# Altium project Urukul.PrjPCB (part 1 of 11)
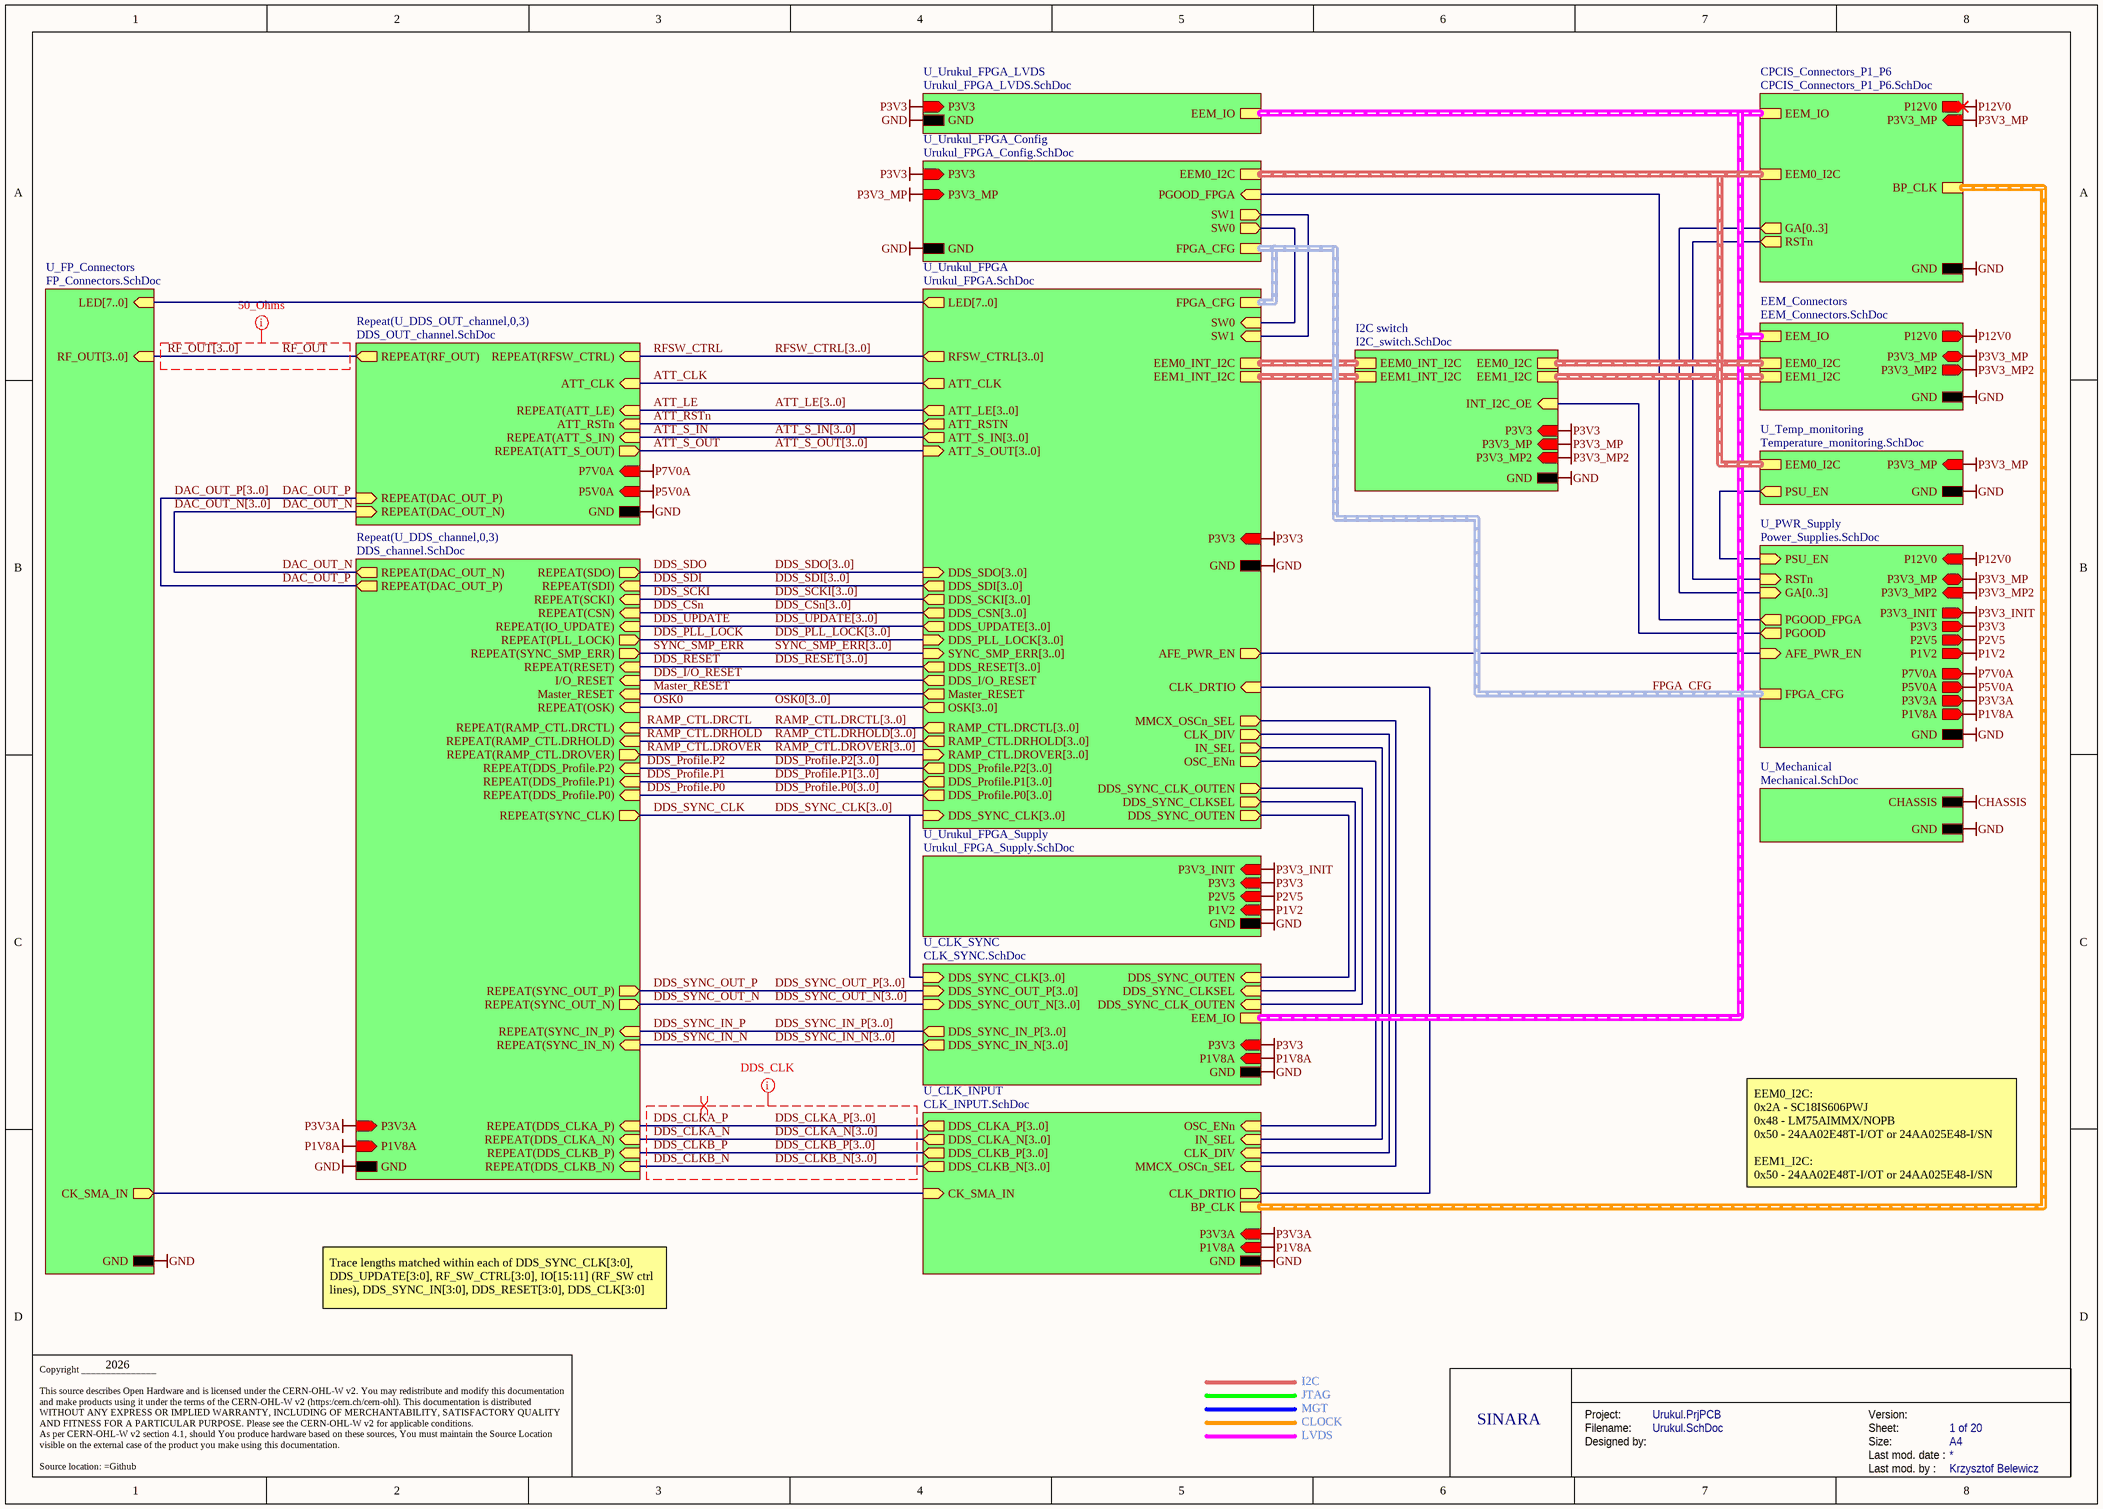
[diagram p0: Urukul.SchDoc]
P_template_version: DIOT-Template v1.3; P_version: 1.6; P_github_link: https://github.com/sinara-hw/Urukul; P_author3: Krzysztof Belewicz; P_author2: Filip Światkowski, Paweł Kulik, Maciej Przybysz; P_author1: Grzegorz Kasprowicz
20 sheets, 1353 parts. Net scope: strictly hierarchical (ports join the sheet entries above them; power ports are local).
Board file: Urukul.PcbDoc
Sheets:
  Urukul.SchDoc
    CPCIS_Connectors_P1_P6 = CPCIS_Connectors_P1_P6.SchDoc
      U_DIOT_signal_routing = DIOT_signal_routing.SchDoc
    EEM_Connectors = EEM_Connectors.SchDoc
    U_Temp_monitoring = Temperature_monitoring.SchDoc
    U_Mechanical = Mechanical.SchDoc
    U_FP_Connectors = FP_Connectors.SchDoc
    U_CLK_INPUT = CLK_INPUT.SchDoc
    U_Urukul_FPGA_Supply = Urukul_FPGA_Supply.SchDoc
    U_DDS_OUT_channel0 = DDS_OUT_channel.SchDoc
    U_DDS_OUT_channel1 = DDS_OUT_channel.SchDoc
    U_DDS_OUT_channel2 = DDS_OUT_channel.SchDoc
    U_DDS_OUT_channel3 = DDS_OUT_channel.SchDoc
    U_DDS_channel0 = DDS_channel.SchDoc
    U_DDS_channel1 = DDS_channel.SchDoc
    U_DDS_channel2 = DDS_channel.SchDoc
    U_DDS_channel3 = DDS_channel.SchDoc
    U_Urukul_FPGA = Urukul_FPGA.SchDoc
    U_CLK_SYNC = CLK_SYNC.SchDoc
    U_Urukul_FPGA_Config = Urukul_FPGA_Config.SchDoc
    U_Urukul_FPGA_LVDS = Urukul_FPGA_LVDS.SchDoc
    I2C switch = I2C_switch.SchDoc
    U_PWR_Supply = Power_Supplies.SchDoc
      U_Power-up_delay = Power-up_delay.SchDoc
      U_Power_main_DCDC = Power_main_DCDC.SchDoc
      LEDs = LEDs.SchDoc

## Sheet Urukul.SchDoc: =DocumentName
size A3; DocumentNumber: 1; Revision: 0; SheetNumber: 1; SheetTotal: 20; Version: 1.6; Author 1: Grzegorz Kasprowicz; Author 2: Filip Światkowski, Paweł Kulik, Maciej Przybysz; Author 3: Krzysztof Belewicz; Github: https://github.com/sinara-hw/Urukul; Last modified by: Krzysztof Belewicz

### Sub-sheets
CPCIS_Connectors_P1_P6 = CPCIS_Connectors_P1_P6.SchDoc: P12V0 (out), P3V3_MP (in), EEM_IO (harness EEM_LVDS), EEM0_I2C (harness I2C), BP_CLK (harness CLK_DIFF), GA[0..3] (out), GND, RSTn (out)
EEM_Connectors = EEM_Connectors.SchDoc: P3V3_MP (bidir), P12V0 (out), EEM_IO (harness EEM_LVDS), EEM0_I2C (harness I2C), GND, P3V3_MP2 (out), EEM1_I2C (harness I2C)
I2C switch = I2C_switch.SchDoc: GND, P3V3 (in), P3V3_MP (in), INT_I2C_OE (in), EEM0_I2C (harness I2C), EEM1_I2C (harness I2C), EEM0_INT_I2C (harness I2C), EEM1_INT_I2C (harness I2C), P3V3_MP2 (in)
Repeat(U_DDS_channel,0,3) = DDS_channel.SchDoc: REPEAT(CSN) (in), REPEAT(SDI) (in), REPEAT(SCKI) (in), REPEAT(SDO) (out), REPEAT(DAC_OUT_P) (out), REPEAT(DAC_OUT_N) (out), REPEAT(RESET) (in), REPEAT(IO_UPDATE) (in), REPEAT(SYNC_CLK) (out), I/O_RESET (in), REPEAT(SYNC_SMP_ERR) (out), REPEAT(PLL_LOCK) (out), Master_RESET (in), REPEAT(OSK) (in), GND, P1V8A (in), P3V3A (in), REPEAT(SYNC_IN_P) (in), REPEAT(SYNC_IN_N) (in), REPEAT(SYNC_OUT_P) (out), REPEAT(SYNC_OUT_N) (out), REPEAT(DDS_CLKB_P) (in), REPEAT(DDS_CLKB_N) (in), REPEAT(DDS_CLKA_P) (in), REPEAT(DDS_CLKA_N) (in), REPEAT(RAMP_CTL.DROVER) (out), REPEAT(RAMP_CTL.DRHOLD) (in), REPEAT(RAMP_CTL.DRCTL) (in), REPEAT(DDS_Profile.P2) (in), REPEAT(DDS_Profile.P1) (in), REPEAT(DDS_Profile.P0) (in)
Repeat(U_DDS_OUT_channel,0,3) = DDS_OUT_channel.SchDoc: REPEAT(RF_OUT) (out), REPEAT(RFSW_CTRL) (in), ATT_CLK (in), REPEAT(ATT_S_IN) (in), REPEAT(ATT_LE) (in), ATT_RSTn (in), REPEAT(ATT_S_OUT) (out), GND, P7V0A (in), P5V0A (in), REPEAT(DAC_OUT_P) (in), REPEAT(DAC_OUT_N) (in)
U_CLK_INPUT = CLK_INPUT.SchDoc: DDS_CLKA_P[3..0] (out), DDS_CLKA_N[3..0] (out), BP_CLK (harness CLK_DIFF), CK_SMA_IN (in), IN_SEL (in), CLK_DIV (in), MMCX_OSCn_SEL (in), OSC_ENn (in), DDS_CLKB_P[3..0] (out), DDS_CLKB_N[3..0] (out), P3V3A (in), GND, P1V8A (in), CLK_DRTIO (out)
U_CLK_SYNC = CLK_SYNC.SchDoc: DDS_SYNC_OUT_P[3..0] (in), DDS_SYNC_OUT_N[3..0] (in), DDS_SYNC_IN_P[3..0] (out), DDS_SYNC_IN_N[3..0] (out), DDS_SYNC_CLK_OUTEN (in), DDS_SYNC_CLKSEL (in), DDS_SYNC_OUTEN (in), EEM_IO (harness EEM_LVDS), DDS_SYNC_CLK[3..0] (in), GND, P3V3 (in), P1V8A (in)
U_FP_Connectors = FP_Connectors.SchDoc: GND, CK_SMA_IN (out), LED[7..0] (in), RF_OUT[3..0] (in)
U_Mechanical = Mechanical.SchDoc: CHASSIS, GND
U_PWR_Supply = Power_Supplies.SchDoc: GND, P12V0 (in), P3V3 (out), P3V3_MP (bidir), PGOOD (out), GA[0..3] (in), RSTn (in), PSU_EN (in), P3V3_MP2 (in), P3V3_INIT (out), P2V5 (out), P1V2 (out), P3V3A (out), P1V8A (out), P5V0A (out), P7V0A (out), AFE_PWR_EN (in), PGOOD_FPGA (out), FPGA_CFG (harness FPGA_CFG)
U_Temp_monitoring = Temperature_monitoring.SchDoc: GND, P3V3_MP (in), EEM0_I2C (harness I2C), PSU_EN (out)
U_Urukul_FPGA = Urukul_FPGA.SchDoc: EEM0_INT_I2C (harness I2C), EEM1_INT_I2C (harness I2C), LED[7..0] (out), FPGA_CFG (harness FPGA_CFG), SW0 (in), RFSW_CTRL[3..0] (out), DDS_SYNC_CLK[3..0] (in), ATT_S_IN[3..0] (out), ATT_S_OUT[3..0] (in), OSK[3..0] (out), ATT_CLK (out), ATT_LE[3..0] (out), ATT_RSTN (out), Master_RESET (out), DDS_UPDATE[3..0] (out), DDS_CSN[3..0] (out), DDS_SCKI[3..0] (out), DDS_SDI[3..0] (out), DDS_SDO[3..0] (in), DDS_I/O_RESET (out), DDS_PLL_LOCK[3..0] (in), SYNC_SMP_ERR[3..0] (in), DDS_RESET[3..0] (out), SW1 (in), GND, P3V3 (in), AFE_PWR_EN (out), DDS_SYNC_CLKSEL (out), DDS_SYNC_OUTEN (out), DDS_SYNC_CLK_OUTEN (out), IN_SEL (out), CLK_DIV (out), MMCX_OSCn_SEL (out), OSC_ENn (out), CLK_DRTIO (in), RAMP_CTL.DRCTL[3..0] (out), RAMP_CTL.DRHOLD[3..0] (out), RAMP_CTL.DROVER[3..0] (in), DDS_Profile.P2[3..0] (out), DDS_Profile.P1[3..0] (out), DDS_Profile.P0[3..0] (out)
U_Urukul_FPGA_Config = Urukul_FPGA_Config.SchDoc: PGOOD_FPGA (in), FPGA_CFG (harness FPGA_CFG), SW0 (out), SW1 (out), GND, P3V3_MP (in), P3V3 (in), EEM0_I2C (harness I2C)
U_Urukul_FPGA_LVDS = Urukul_FPGA_LVDS.SchDoc: EEM_IO (harness EEM_LVDS), GND, P3V3 (in)
U_Urukul_FPGA_Supply = Urukul_FPGA_Supply.SchDoc: P3V3_INIT (in), P3V3 (in), P2V5 (in), P1V2 (in), GND

### Nets
GND: sheet CPCIS_Connectors_P1_P6/GND, sheet EEM_Connectors/GND, sheet U_Temp_monitoring/GND, sheet U_Mechanical/GND, sheet U_FP_Connectors/GND, sheet U_CLK_INPUT/GND, sheet U_Urukul_FPGA_Supply/GND, sheet Repeat(U_DDS_OUT_channel,0,3)/GND, sheet Repeat(U_DDS_channel,0,3)/GND, sheet U_Urukul_FPGA/GND, sheet U_CLK_SYNC/GND, sheet U_Urukul_FPGA_Config/GND, sheet U_Urukul_FPGA_LVDS/GND, sheet I2C switch/GND, sheet U_PWR_Supply/GND
P1V2: sheet U_Urukul_FPGA_Supply/P1V2, sheet U_PWR_Supply/P1V2
P1V8A: sheet U_CLK_INPUT/P1V8A, sheet Repeat(U_DDS_channel,0,3)/P1V8A, sheet U_CLK_SYNC/P1V8A, sheet U_PWR_Supply/P1V8A
P2V5: sheet U_Urukul_FPGA_Supply/P2V5, sheet U_PWR_Supply/P2V5
P3V3: sheet U_Urukul_FPGA_Supply/P3V3, sheet U_Urukul_FPGA/P3V3, sheet U_CLK_SYNC/P3V3, sheet U_Urukul_FPGA_Config/P3V3, sheet U_Urukul_FPGA_LVDS/P3V3, sheet I2C switch/P3V3, sheet U_PWR_Supply/P3V3
P3V3_INIT: sheet U_Urukul_FPGA_Supply/P3V3_INIT, sheet U_PWR_Supply/P3V3_INIT
P3V3_MP: sheet CPCIS_Connectors_P1_P6/P3V3_MP, sheet EEM_Connectors/P3V3_MP, sheet U_Temp_monitoring/P3V3_MP, sheet U_Urukul_FPGA_Config/P3V3_MP, sheet I2C switch/P3V3_MP, sheet U_PWR_Supply/P3V3_MP
P3V3_MP2: sheet EEM_Connectors/P3V3_MP2, sheet I2C switch/P3V3_MP2, sheet U_PWR_Supply/P3V3_MP2
P3V3A: sheet U_CLK_INPUT/P3V3A, sheet Repeat(U_DDS_channel,0,3)/P3V3A, sheet U_PWR_Supply/P3V3A
P5V0A: sheet Repeat(U_DDS_OUT_channel,0,3)/P5V0A, sheet U_PWR_Supply/P5V0A
P7V0A: sheet Repeat(U_DDS_OUT_channel,0,3)/P7V0A, sheet U_PWR_Supply/P7V0A
P12V0: sheet CPCIS_Connectors_P1_P6/P12V0, sheet EEM_Connectors/P12V0, sheet U_PWR_Supply/P12V0
AFE_PWR_EN: sheet U_Urukul_FPGA/AFE_PWR_EN, sheet U_PWR_Supply/AFE_PWR_EN
ATT_CLK: sheet Repeat(U_DDS_OUT_channel,0,3)/ATT_CLK, sheet U_Urukul_FPGA/ATT_CLK
ATT_LE: sheet Repeat(U_DDS_OUT_channel,0,3)/REPEAT(ATT_LE)
ATT_RSTn: sheet Repeat(U_DDS_OUT_channel,0,3)/ATT_RSTn, sheet U_Urukul_FPGA/ATT_RSTN
ATT_S_IN: sheet Repeat(U_DDS_OUT_channel,0,3)/REPEAT(ATT_S_IN)
ATT_S_OUT: sheet Repeat(U_DDS_OUT_channel,0,3)/REPEAT(ATT_S_OUT)
CK_SMA_IN: sheet U_FP_Connectors/CK_SMA_IN, sheet U_CLK_INPUT/CK_SMA_IN
CLK_DIV: sheet U_CLK_INPUT/CLK_DIV, sheet U_Urukul_FPGA/CLK_DIV
CLK_DRTIO: sheet U_CLK_INPUT/CLK_DRTIO, sheet U_Urukul_FPGA/CLK_DRTIO
DAC_OUT_N: sheet Repeat(U_DDS_OUT_channel,0,3)/REPEAT(DAC_OUT_N), sheet Repeat(U_DDS_channel,0,3)/REPEAT(DAC_OUT_N)
DAC_OUT_P: sheet Repeat(U_DDS_OUT_channel,0,3)/REPEAT(DAC_OUT_P), sheet Repeat(U_DDS_channel,0,3)/REPEAT(DAC_OUT_P)
DDS_CLKA_N: sheet Repeat(U_DDS_channel,0,3)/REPEAT(DDS_CLKA_N)
DDS_CLKA_P: sheet Repeat(U_DDS_channel,0,3)/REPEAT(DDS_CLKA_P)
DDS_CLKB_N: sheet Repeat(U_DDS_channel,0,3)/REPEAT(DDS_CLKB_N)
DDS_CLKB_P: sheet Repeat(U_DDS_channel,0,3)/REPEAT(DDS_CLKB_P)
DDS_CSn: sheet Repeat(U_DDS_channel,0,3)/REPEAT(CSN)
DDS_I/O_RESET: sheet Repeat(U_DDS_channel,0,3)/I/O_RESET, sheet U_Urukul_FPGA/DDS_I/O_RESET
DDS_PLL_LOCK: sheet Repeat(U_DDS_channel,0,3)/REPEAT(PLL_LOCK)
DDS_Profile.P0: sheet Repeat(U_DDS_channel,0,3)/REPEAT(DDS_Profile.P0)
DDS_Profile.P1: sheet Repeat(U_DDS_channel,0,3)/REPEAT(DDS_Profile.P1)
DDS_Profile.P2: sheet Repeat(U_DDS_channel,0,3)/REPEAT(DDS_Profile.P2)
DDS_RESET: sheet Repeat(U_DDS_channel,0,3)/REPEAT(RESET)
DDS_SCKI: sheet Repeat(U_DDS_channel,0,3)/REPEAT(SCKI)
DDS_SDI: sheet Repeat(U_DDS_channel,0,3)/REPEAT(SDI)
DDS_SDO: sheet Repeat(U_DDS_channel,0,3)/REPEAT(SDO)
DDS_SYNC_CLK: sheet Repeat(U_DDS_channel,0,3)/REPEAT(SYNC_CLK)
DDS_SYNC_CLK_OUTEN: sheet U_Urukul_FPGA/DDS_SYNC_CLK_OUTEN, sheet U_CLK_SYNC/DDS_SYNC_CLK_OUTEN
DDS_SYNC_CLKSEL: sheet U_Urukul_FPGA/DDS_SYNC_CLKSEL, sheet U_CLK_SYNC/DDS_SYNC_CLKSEL
DDS_SYNC_IN_N: sheet Repeat(U_DDS_channel,0,3)/REPEAT(SYNC_IN_N)
DDS_SYNC_IN_P: sheet Repeat(U_DDS_channel,0,3)/REPEAT(SYNC_IN_P)
DDS_SYNC_OUT_N: sheet Repeat(U_DDS_channel,0,3)/REPEAT(SYNC_OUT_N)
DDS_SYNC_OUT_P: sheet Repeat(U_DDS_channel,0,3)/REPEAT(SYNC_OUT_P)
DDS_SYNC_OUTEN: sheet U_Urukul_FPGA/DDS_SYNC_OUTEN, sheet U_CLK_SYNC/DDS_SYNC_OUTEN
DDS_UPDATE: sheet Repeat(U_DDS_channel,0,3)/REPEAT(IO_UPDATE)
IN_SEL: sheet U_CLK_INPUT/IN_SEL, sheet U_Urukul_FPGA/IN_SEL
INT_I2C_OE: sheet I2C switch/INT_I2C_OE, sheet U_PWR_Supply/PGOOD
Master_RESET: sheet Repeat(U_DDS_channel,0,3)/Master_RESET, sheet U_Urukul_FPGA/Master_RESET
MMCX_OSCn_SEL: sheet U_CLK_INPUT/MMCX_OSCn_SEL, sheet U_Urukul_FPGA/MMCX_OSCn_SEL
OSC_ENn: sheet U_CLK_INPUT/OSC_ENn, sheet U_Urukul_FPGA/OSC_ENn
OSK0: sheet Repeat(U_DDS_channel,0,3)/REPEAT(OSK)
PGOOD_FPGA: sheet U_Urukul_FPGA_Config/PGOOD_FPGA, sheet U_PWR_Supply/PGOOD_FPGA
PSU_EN: sheet U_Temp_monitoring/PSU_EN, sheet U_PWR_Supply/PSU_EN
RAMP_CTL.DRCTL: sheet Repeat(U_DDS_channel,0,3)/REPEAT(RAMP_CTL.DRCTL)
RAMP_CTL.DRHOLD: sheet Repeat(U_DDS_channel,0,3)/REPEAT(RAMP_CTL.DRHOLD)
RAMP_CTL.DROVER: sheet Repeat(U_DDS_channel,0,3)/REPEAT(RAMP_CTL.DROVER)
RF_OUT: sheet Repeat(U_DDS_OUT_channel,0,3)/REPEAT(RF_OUT)
RFSW_CTRL: sheet Repeat(U_DDS_OUT_channel,0,3)/REPEAT(RFSW_CTRL)
RSTn: sheet CPCIS_Connectors_P1_P6/RSTn, sheet U_PWR_Supply/RSTn
SW0: sheet U_Urukul_FPGA/SW0, sheet U_Urukul_FPGA_Config/SW0
SW1: sheet U_Urukul_FPGA/SW1, sheet U_Urukul_FPGA_Config/SW1
SYNC_SMP_ERR: sheet Repeat(U_DDS_channel,0,3)/REPEAT(SYNC_SMP_ERR)

### Buses and harness runs
bus ATT_LE[3..0] = sheet U_Urukul_FPGA/ATT_LE[3..0]
bus ATT_S_IN[3..0] = sheet U_Urukul_FPGA/ATT_S_IN[3..0]
bus ATT_S_OUT[3..0] = sheet U_Urukul_FPGA/ATT_S_OUT[3..0]
bus DAC_OUT_N[3..0]
bus DAC_OUT_P[3..0]
bus DDS_CLKA_N[3..0] = sheet U_CLK_INPUT/DDS_CLKA_N[3..0]
bus DDS_CLKA_P[3..0] = sheet U_CLK_INPUT/DDS_CLKA_P[3..0]
bus DDS_CLKB_N[3..0] = sheet U_CLK_INPUT/DDS_CLKB_N[3..0]
bus DDS_CLKB_P[3..0] = sheet U_CLK_INPUT/DDS_CLKB_P[3..0]
bus DDS_CSn[3..0] = sheet U_Urukul_FPGA/DDS_CSN[3..0]
bus DDS_PLL_LOCK[3..0] = sheet U_Urukul_FPGA/DDS_PLL_LOCK[3..0]
bus DDS_Profile.P0[3..0] = sheet U_Urukul_FPGA/DDS_Profile.P0[3..0]
bus DDS_Profile.P1[3..0] = sheet U_Urukul_FPGA/DDS_Profile.P1[3..0]
bus DDS_Profile.P2[3..0] = sheet U_Urukul_FPGA/DDS_Profile.P2[3..0]
bus DDS_RESET[3..0] = sheet U_Urukul_FPGA/DDS_RESET[3..0]
bus DDS_SCKI[3..0] = sheet U_Urukul_FPGA/DDS_SCKI[3..0]
bus DDS_SDI[3..0] = sheet U_Urukul_FPGA/DDS_SDI[3..0]
bus DDS_SDO[3..0] = sheet U_Urukul_FPGA/DDS_SDO[3..0]
bus DDS_SYNC_CLK[3..0] = sheet U_CLK_SYNC/DDS_SYNC_CLK[3..0] = sheet U_Urukul_FPGA/DDS_SYNC_CLK[3..0]
bus DDS_SYNC_IN_N[3..0] = sheet U_CLK_SYNC/DDS_SYNC_IN_N[3..0]
bus DDS_SYNC_IN_P[3..0] = sheet U_CLK_SYNC/DDS_SYNC_IN_P[3..0]
bus DDS_SYNC_OUT_N[3..0] = sheet U_CLK_SYNC/DDS_SYNC_OUT_N[3..0]
bus DDS_SYNC_OUT_P[3..0] = sheet U_CLK_SYNC/DDS_SYNC_OUT_P[3..0]
bus DDS_UPDATE[3..0] = sheet U_Urukul_FPGA/DDS_UPDATE[3..0]
bus OSK0[3..0] = sheet U_Urukul_FPGA/OSK[3..0]
bus RAMP_CTL.DRCTL[3..0] = sheet U_Urukul_FPGA/RAMP_CTL.DRCTL[3..0]
bus RAMP_CTL.DRHOLD[3..0] = sheet U_Urukul_FPGA/RAMP_CTL.DRHOLD[3..0]
bus RAMP_CTL.DROVER[3..0] = sheet U_Urukul_FPGA/RAMP_CTL.DROVER[3..0]
bus RF_OUT[3..0] = sheet U_FP_Connectors/RF_OUT[3..0]
bus RFSW_CTRL[3..0] = sheet U_Urukul_FPGA/RFSW_CTRL[3..0]
bus sheet CPCIS_Connectors_P1_P6/GA[0..3] = sheet U_PWR_Supply/GA[0..3]
bus sheet U_FP_Connectors/LED[7..0] = sheet U_Urukul_FPGA/LED[7..0]
bus SYNC_SMP_ERR[3..0] = sheet U_Urukul_FPGA/SYNC_SMP_ERR[3..0]
harness FPGA_CFG = sheet U_PWR_Supply/FPGA_CFG = sheet U_Urukul_FPGA/FPGA_CFG = sheet U_Urukul_FPGA_Config/FPGA_CFG
harness sheet CPCIS_Connectors_P1_P6/BP_CLK = sheet U_CLK_INPUT/BP_CLK
harness sheet CPCIS_Connectors_P1_P6/EEM0_I2C = sheet EEM_Connectors/EEM0_I2C = sheet I2C switch/EEM0_I2C = sheet U_Temp_monitoring/EEM0_I2C = sheet U_Urukul_FPGA_Config/EEM0_I2C
harness sheet CPCIS_Connectors_P1_P6/EEM_IO = sheet EEM_Connectors/EEM_IO = sheet U_CLK_SYNC/EEM_IO = sheet U_Urukul_FPGA_LVDS/EEM_IO
harness sheet EEM_Connectors/EEM1_I2C = sheet I2C switch/EEM1_I2C
harness sheet I2C switch/EEM0_INT_I2C = sheet U_Urukul_FPGA/EEM0_INT_I2C
harness sheet I2C switch/EEM1_INT_I2C = sheet U_Urukul_FPGA/EEM1_INT_I2C

### Layout directives
net class DDS_CLK: DDS_CLKA_N, DDS_CLKA_N[3..0], DDS_CLKA_P, DDS_CLKA_P[3..0], DDS_CLKB_N, DDS_CLKB_N[3..0], DDS_CLKB_P, DDS_CLKB_P[3..0]
net class 50_Ohms: RF_OUT, RF_OUT[3..0]
differential pair: DDS_CLKA_N, DDS_CLKA_N[3..0], DDS_CLKA_P, DDS_CLKA_P[3..0], DDS_CLKB_N, DDS_CLKB_N[3..0], DDS_CLKB_P, DDS_CLKB_P[3..0]

### Notes on the sheet
- EEM0_I2C:
  0x2A - SC18IS606PWJ
  0x48 - LM75AIMMX/NOPB
  0x50 - 24AA02E48T-I/OT or 24AA025E48-I/SN
  EEM1_I2C:
  0x50 - 24AA02E48T-I/OT or 24AA025E48-I/SN
- Trace lengths matched within each of DDS_SYNC_CLK[3:0], DDS_UPDATE[3:0], RF_SW_CTRL[3:0], IO[15:11] (RF_SW ctrl lines), DDS_SYNC_IN[3:0], DDS_RESET[3:0], DDS_CLK[3:0]
- 2026
- I2C
- JTAG
- MGT
- CLOCK
- LVDS
- SINARA
- Project:
- Designed by:
- Filename:
- Size:
- Version:
- Last mod. date :
- Sheet:
- A4
- Copyright _______________
  This source describes Open Hardware and is licensed under the CERN-OHL-W v2. You may redistribute and modify this documentation and make products using it under the terms of the CERN-OHL-W v2 (https:/cern.ch/cern-ohl). This documentation is distributed WITHOUT ANY EXPRESS OR IMPLIED WARRANTY, INCLUDING OF MERCHANTABILITY, SATISFACTORY QUALITY AND FITNESS FOR A PARTICULAR PURPOSE. Please see the CERN-OHL-W v2 for applicable conditions.
  As per CERN-OHL-W v2 section 4.1, should You produce hardware based on these sources, You must maintain the Source Location visible on the external case of the product you make using this documentation.
  Source location: =Github
- Last mod. by :

## Sheet CPCIS_Connectors_P1_P6.SchDoc: =DocumentName
size A3; SPICEModelCacheRMUUFYQV: <root> / <DocumentId>RMUUFYQV</DocumentId> / </root>; DocumentNumber: 1; Revision: 0; SheetNumber: 6; SheetTotal: 17; Version: 1.6; Author 1: Grzegorz Kasprowicz; Author 2: Filip Światkowski, Paweł Kulik, Maciej Przybysz; Author 3: Krzysztof Belewicz; Github: https://github.com/sinara-hw/Urukul; Last modified by: Krzysztof Belewicz
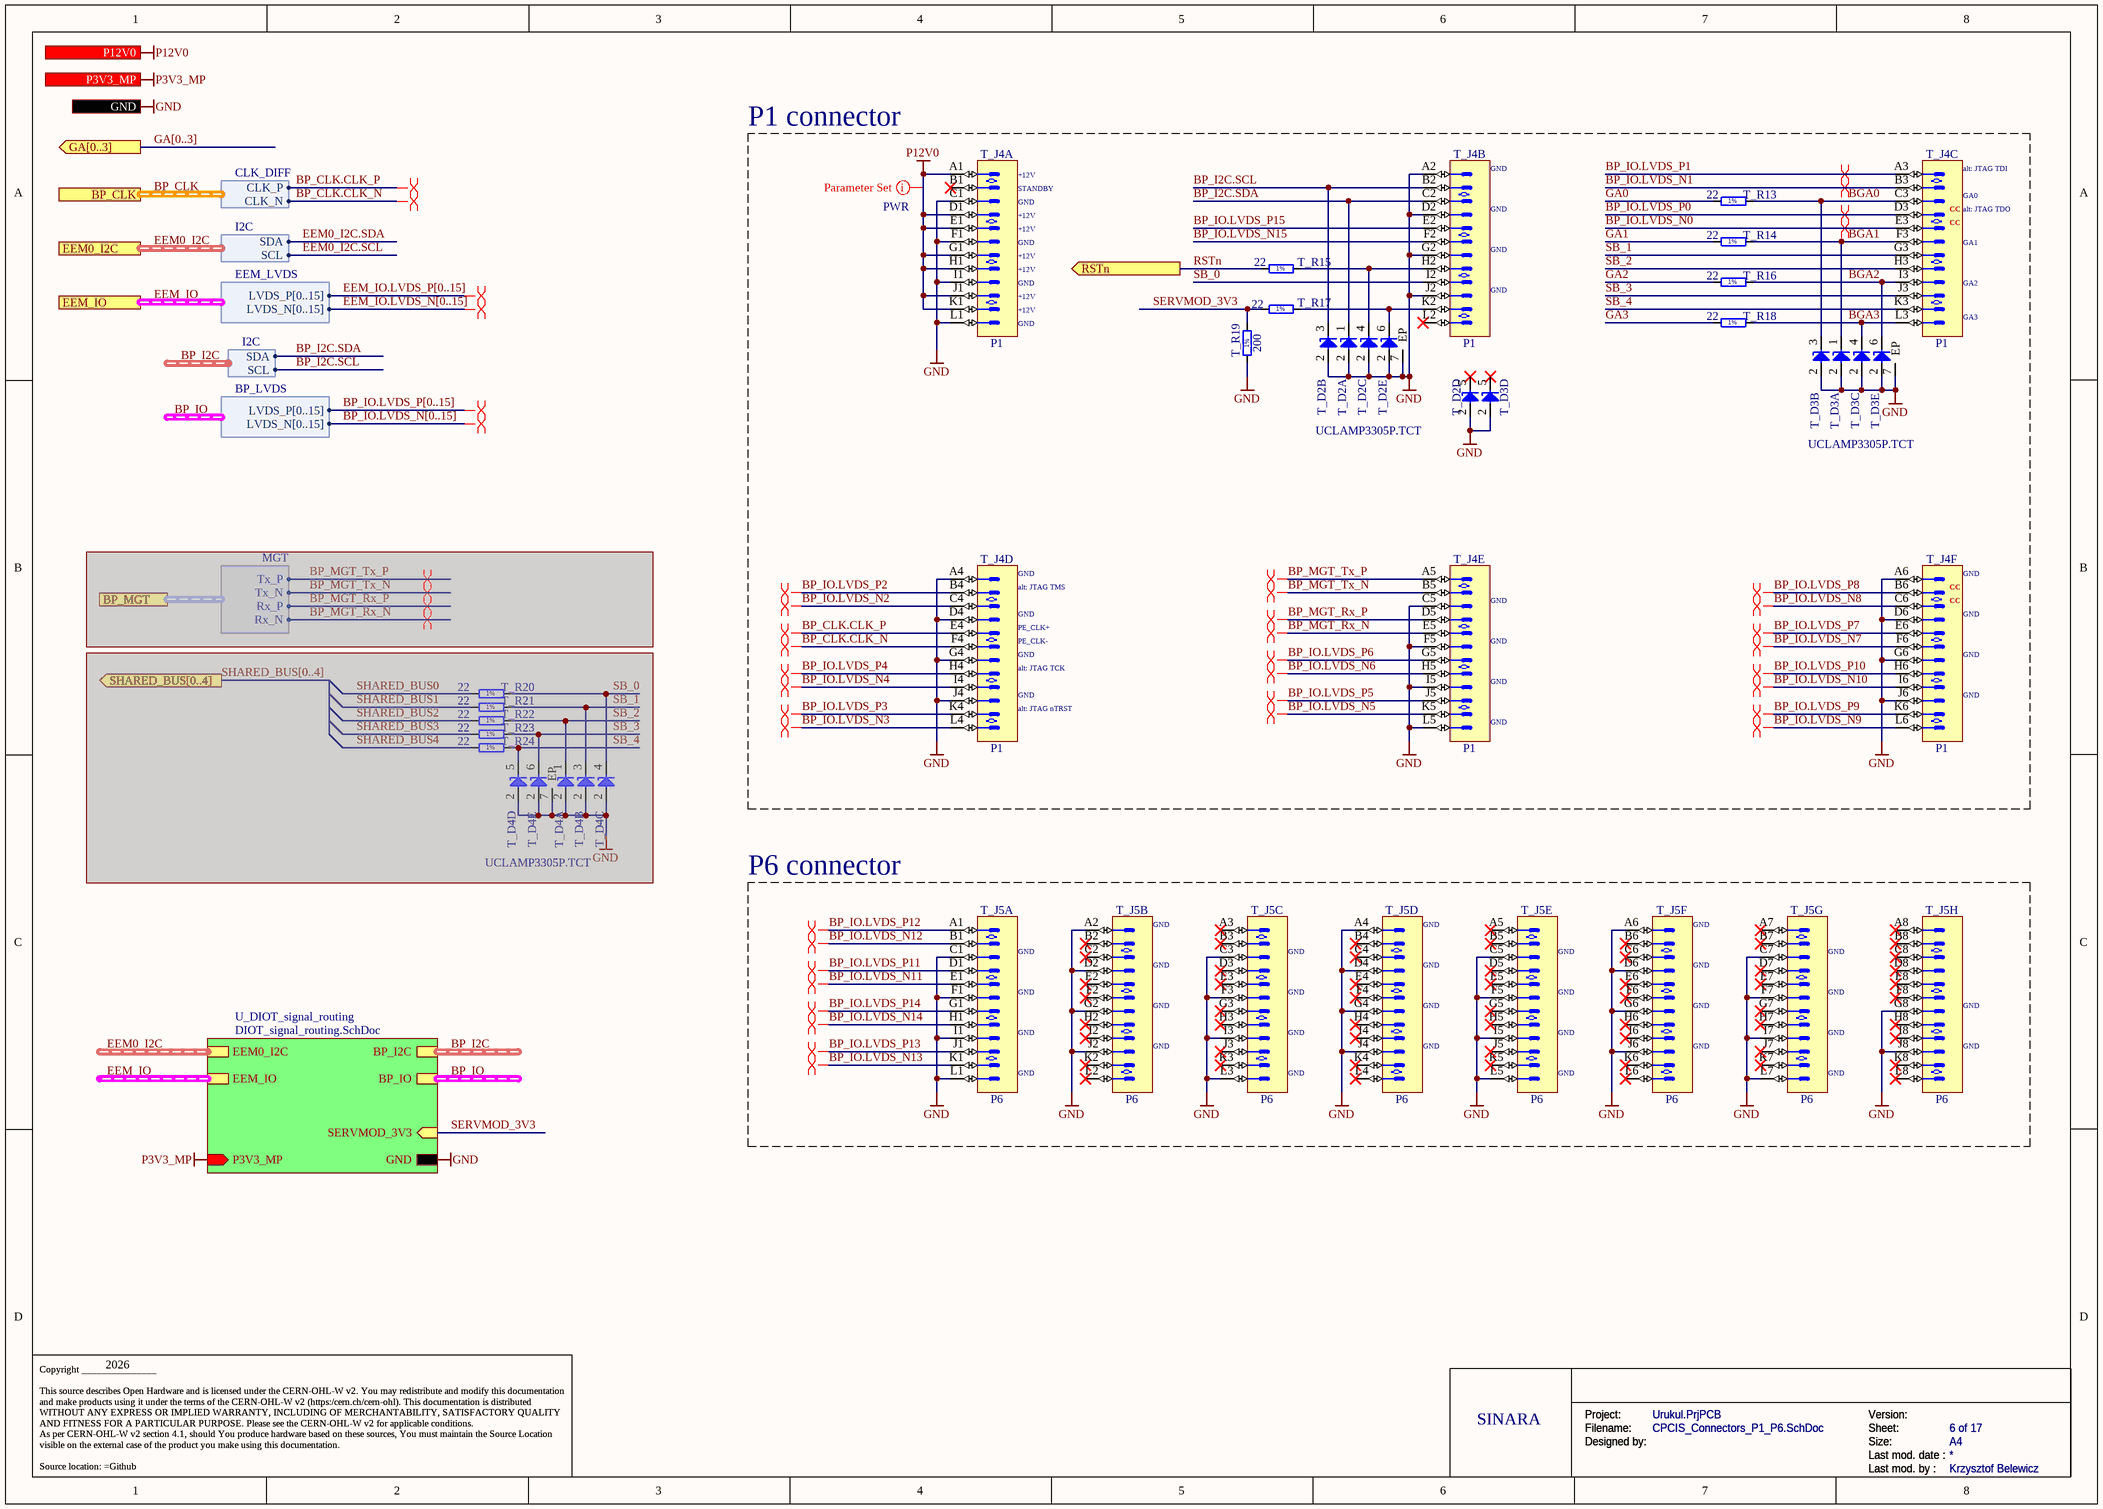
[diagram p1: CPCIS_Connectors_P1_P6.SchDoc]

### Parts
T_D2  UCLAMP3305P.TCT  [SON50P160X65_HS-7N]  (value not drawn)  (parts A,B,C,D,E of 5)
T_D3  UCLAMP3305P.TCT  [SON50P160X65_HS-7N]  (value not drawn)  (parts A,B,C,D,E of 5)
T_D4  UCLAMP3305P.TCT  [SON50P160X65_HS-7N]  (value not drawn)  (parts A,B,C,D,E of 5)  (masked out: inside a compile mask, not in the netlist)
T_J4  P1  [AMPHENOL_10052825-101LF]  (parts A,B,C,D,E,F of 6)
T_J5  P6  [AMPHENOL_10052838-101LF]  (parts A,B,C,D,E,F,G,H of 8)
T_R13  22  [RESC1005X40N]
T_R14  22  [RESC1005X40N]
T_R15  22  [RESC1005X40N]
T_R16  22  [RESC1005X40N]
T_R17  22  [RESC1005X40N]
T_R18  22  [RESC1005X40N]
T_R19  200  [RESC1005X40N]
T_R20  22  [RESC1005X40N]  (masked out: inside a compile mask, not in the netlist)
T_R21  22  [RESC1005X40N]  (masked out: inside a compile mask, not in the netlist)
T_R22  22  [RESC1005X40N]  (masked out: inside a compile mask, not in the netlist)
T_R23  22  [RESC1005X40N]  (masked out: inside a compile mask, not in the netlist)
T_R24  22  [RESC1005X40N]  (masked out: inside a compile mask, not in the netlist)

### Blocks framed on the sheet
P1 connector: T_D2 T_D3 T_J4 T_R13-T_R19
P6 connector: T_J5

### Sub-sheets
U_DIOT_signal_routing = DIOT_signal_routing.SchDoc: BP_I2C (harness I2C), EEM0_I2C (harness I2C), EEM_IO (harness EEM_LVDS), BP_IO (harness BP_LVDS), SERVMOD_3V3 (in), GND, P3V3_MP (in)

### Ports
BP_CLK (harness CLK_DIFF), BP_MGT (harness MGT), EEM0_I2C (harness I2C), EEM_IO (harness EEM_LVDS), GA[0..3] (out), GND, P3V3_MP (in), P12V0 (out), RSTn (out), SHARED_BUS[0..4] (out)

### Harnesses
MGT: Tx_P, Tx_N, Rx_P, Rx_N
CLK_DIFF: CLK_N, CLK_P
I2C: SDA, SCL
EEM_LVDS: LVDS_P[0..15], LVDS_N[0..15]
BP_LVDS: LVDS_N[0..15], LVDS_P[0..15]

### Nets
GND: T_D2.2(A) T_D2.7(EP) T_D3.2(A) T_D3.7(EP) T_J4.A2 T_J4.A4 T_J4.A6 T_J4.C1 T_J4.C5 T_J4.D2 T_J4.D4 T_J4.D6 T_J4.F1 T_J4.F5 T_J4.G2 T_J4.G4 T_J4.G6 T_J4.I1 T_J4.I5 T_J4.J2 T_J4.J4 T_J4.J6 T_J4.L1 T_J4.L5 T_J5.A2 T_J5.A4 T_J5.A6 T_J5.C1 T_J5.C3 T_J5.C5 T_J5.C7 T_J5.D2 T_J5.D4 T_J5.D6 T_J5.F1 T_J5.F3 T_J5.F5 T_J5.F7 T_J5.G2 T_J5.G4 T_J5.G6 T_J5.G8 T_J5.I1 T_J5.I3 T_J5.I5 T_J5.I7 T_J5.J2 T_J5.J4 T_J5.J6 T_J5.J8 T_J5.L1 T_J5.L3 T_J5.L5 T_J5.L7 T_R19.1 ; port GND, sheet U_DIOT_signal_routing/GND
P3V3_MP: port P3V3_MP, sheet U_DIOT_signal_routing/P3V3_MP
P12V0: T_J4.A1 T_J4.D1 T_J4.E1 T_J4.G1 T_J4.H1 T_J4.J1 T_J4.K1 ; port P12V0
BGA0: T_D3.3(C) T_J4.C3 T_R13.2
BGA1: T_D3.1(C) T_J4.F3 T_R14.2
BGA2: T_D3.6(C) T_J4.I3 T_R16.2
BGA3: T_D3.4(C) T_J4.L3 T_R18.2
BP_CLK.CLK_N: T_J4.F4 ; port BP_CLK.CLK_N
BP_CLK.CLK_P: T_J4.E4 ; port BP_CLK.CLK_P
BP_I2C.SCL: T_D2.3(C) T_J4.B2 ; sheet U_DIOT_signal_routing/BP_I2C.SCL
BP_I2C.SDA: T_D2.1(C) T_J4.C2 ; sheet U_DIOT_signal_routing/BP_I2C.SDA
BP_IO.LVDS_N0: T_J4.E3
BP_IO.LVDS_N1: T_J4.B3
BP_IO.LVDS_N2: T_J4.C4
BP_IO.LVDS_N3: T_J4.L4
BP_IO.LVDS_N4: T_J4.I4
BP_IO.LVDS_N5: T_J4.K5
BP_IO.LVDS_N6: T_J4.H5
BP_IO.LVDS_N7: T_J4.F6
BP_IO.LVDS_N8: T_J4.C6
BP_IO.LVDS_N9: T_J4.L6
BP_IO.LVDS_N10: T_J4.I6
BP_IO.LVDS_N11: T_J5.E1
BP_IO.LVDS_N12: T_J5.B1
BP_IO.LVDS_N13: T_J5.K1
BP_IO.LVDS_N14: T_J5.H1
BP_IO.LVDS_N15: T_J4.F2
BP_IO.LVDS_P0: T_J4.D3
BP_IO.LVDS_P1: T_J4.A3
BP_IO.LVDS_P2: T_J4.B4
BP_IO.LVDS_P3: T_J4.K4
BP_IO.LVDS_P4: T_J4.H4
BP_IO.LVDS_P5: T_J4.J5
BP_IO.LVDS_P6: T_J4.G5
BP_IO.LVDS_P7: T_J4.E6
BP_IO.LVDS_P8: T_J4.B6
BP_IO.LVDS_P9: T_J4.K6
BP_IO.LVDS_P10: T_J4.H6
BP_IO.LVDS_P11: T_J5.D1
BP_IO.LVDS_P12: T_J5.A1
BP_IO.LVDS_P13: T_J5.J1
BP_IO.LVDS_P14: T_J5.G1
BP_IO.LVDS_P15: T_J4.E2
BP_MGT_Rx_N: T_J4.E5
BP_MGT_Rx_P: T_J4.D5
BP_MGT_Tx_N: T_J4.B5
BP_MGT_Tx_P: T_J4.A5
GA0: T_R13.1
GA1: T_R14.1
GA2: T_R16.1
GA3: T_R18.1
RSTn: T_R15.1 ; port RSTn
SB_0: T_J4.I2
SB_1: T_J4.G3
SB_2: T_J4.H3
SB_3: T_J4.J3
SB_4: T_J4.K3
SERVMOD_3V3: T_R17.1 T_R19.2 ; sheet U_DIOT_signal_routing/SERVMOD_3V3
NetT_D2_4: T_D2.4(C) T_J4.H2 T_R15.2
NetT_D2_6: T_D2.6(C) T_J4.K2 T_R17.2

Not connected (* = marked no-connect by the designer): T_D2 5(C)*; T_D3 5(C)*; T_J4 B1* L2*; T_J5 A3* A5* A7* A8* B2* B3* B4* B5* B6* B7* B8* C2* C4* C6* C8* D3* D5* D7* D8* E2* E3* E4* E5* E6* E7* E8* F2* F4* F6* F8* G3* G5* G7* H2* H3* H4* H5* H6* H7* H8* I2* I4* I6* I8* J3* J5* J7* K2* K3* K4* K5* K6* K7* K8* L2* L4* L6* L8*

### Buses and harness runs
bus BP_IO.LVDS_N[0..15]
bus BP_IO.LVDS_P[0..15]
bus EEM_IO.LVDS_N[0..15]
bus EEM_IO.LVDS_P[0..15]
bus GA[0..3] = port GA[0..3]
harness BP_CLK = port BP_CLK
harness BP_I2C = sheet U_DIOT_signal_routing/BP_I2C
harness BP_IO = sheet U_DIOT_signal_routing/BP_IO
harness EEM0_I2C = port EEM0_I2C
harness EEM0_I2C = sheet U_DIOT_signal_routing/EEM0_I2C
harness EEM_IO = port EEM_IO
harness EEM_IO = sheet U_DIOT_signal_routing/EEM_IO

### Layout directives
differential pair: (no net found under the mark), BP_IO.LVDS_N0, BP_IO.LVDS_N1, BP_IO.LVDS_N2, BP_IO.LVDS_N3, BP_IO.LVDS_N4, BP_IO.LVDS_N5, BP_IO.LVDS_N6, BP_IO.LVDS_N7, BP_IO.LVDS_N8, BP_IO.LVDS_N9, BP_IO.LVDS_N10, BP_IO.LVDS_N11, BP_IO.LVDS_N12, BP_IO.LVDS_N13, BP_IO.LVDS_N14, BP_IO.LVDS_P0, BP_IO.LVDS_P1, BP_IO.LVDS_P2, BP_IO.LVDS_P3, BP_IO.LVDS_P4, BP_IO.LVDS_P5, BP_IO.LVDS_P6, BP_IO.LVDS_P7, BP_IO.LVDS_P8, BP_IO.LVDS_P9, BP_IO.LVDS_P10, BP_IO.LVDS_P11, BP_IO.LVDS_P12, BP_IO.LVDS_P13, BP_IO.LVDS_P14
differential pair; differential pair class Diff_100Ohm: (no net found under the mark), BP_CLK.CLK_N, BP_CLK.CLK_P
differential pair; differential pair class MGT: (no net found under the mark), BP_MGT_Rx_N, BP_MGT_Rx_P, BP_MGT_Tx_N, BP_MGT_Tx_P
net class PWR: P12V0

### Notes on the sheet
- (near T_J4) +12V
- (near T_J4) GND
- (near T_J4) alt: JTAG TDI
- (near T_J4) STANDBY
- (near T_J4) CC
- (near T_J4) alt: JTAG TDO
- (near T_J4) GA1
- (near T_J4) GA0
- (near T_J4) GA2
- (near T_J4) GA3
- (near T_J4) alt: JTAG TMS
- (near T_J4) PE_CLK+
- (near T_J4) PE_CLK-
- (near T_J4) alt: JTAG TCK
- (near T_J4) alt: JTAG nTRST
- (near T_J5) GND
- 2026
- SINARA
- Project:
- Designed by:
- Filename:
- Size:
- Version:
- Last mod. date :
- Sheet:
- A4
- Copyright _______________
  This source describes Open Hardware and is licensed under the CERN-OHL-W v2. You may redistribute and modify this documentation and make products using it under the terms of the CERN-OHL-W v2 (https:/cern.ch/cern-ohl). This documentation is distributed WITHOUT ANY EXPRESS OR IMPLIED WARRANTY, INCLUDING OF MERCHANTABILITY, SATISFACTORY QUALITY AND FITNESS FOR A PARTICULAR PURPOSE. Please see the CERN-OHL-W v2 for applicable conditions.
  As per CERN-OHL-W v2 section 4.1, should You produce hardware based on these sources, You must maintain the Source Location visible on the external case of the product you make using this documentation.
  Source location: =Github
- Last mod. by :
- (in symbol R0402_22R_1%_0.0625W_100PPM) 1%
- (in symbol R0402_200R_1%_0.0625W_100PPM) 1%

### Library data of the parts
T_D2-T_D4 = CMP-004-00037-2: Diode TVS Quint Common Anode Uni-Dir 3.3V 40W 6-Pin SLP EP T/R; Max Operating Temperature: 125°C; Min Operating Temperature: -55°C; Pins: 6; Mounting Technology: Surface Mount
T_J4 = AMPHENOL_10052825-101LF: 72 Contacts Header, 6 Columns, 4 Pairs per Column; Part Description: 72 Contacts, 2mm Pitch, 6 Columns, 4 Pairs per Column, 4 Walls, Right Angle Header; Part Number: AMPHENOL_10052825-101LF; Component Kind: Standard; Component Type: Standard; Pin Count: 72; Family: AirMax VS; Mounted: Yes; Socket: No; SMD: No; PressFit: Yes; Sense: No; Status: None; Manufacturer: AMPHENOL; Manufacturer Part Number: 10052825-101LF; ComponentHeight: 15.35mm; HelpURL: \\cern.ch\dfs\Applications\Altium\Datasheets\AMPHENOL_10052825-101LF.pdf; ComponentLink1URL: \\cern.ch\dfs\Applications\Altium\Datasheets\AMPHENOL_10052825-101LF_Application.pdf; ComponentLink1Description: Application; Author: CERN DEM MR; CreateDate: 19/02/2018; LatestRevisionDate: 19/02/2018; Classname: Overlapping
T_J5 = AMPHENOL_10052838-101LF: 96 Contacts Header, 8 Columns, 4 Pairs per Column; Part Description: 96 Contacts, 2mm Pitch, 8 Columns, 4 Pairs per Column, 4 Walls, Right Angle Header; Part Number: AMPHENOL_10052838-101LF; Component Kind: Standard; Component Type: Standard; Pin Count: 96; Family: AirMax VS; Mounted: Yes; Socket: No; SMD: No; PressFit: Yes; Sense: No; Status: None; Manufacturer: AMPHENOL; Manufacturer Part Number: 10052838-101LF; ComponentHeight: 15.35mm; HelpURL: \\cern.ch\dfs\Applications\Altium\Datasheets\AMPHENOL_10052838-101LF.pdf; ComponentLink1URL: \\cern.ch\dfs\Applications\Altium\Datasheets\AMPHENOL_10052838-101LF_Application.pdf; ComponentLink1Description: Application; Author: CERN DEM MR; CreateDate: 19.02.2018; LatestRevisionDate: 19.02.2018
T_R13-T_R18 T_R20-T_R24 = R0402_22R_1%_0.0625W_100PPM: Resistor - 1%; Part Description: General Purpose Thick Film Chip Resistor; Manufacturer: GENERIC; Manufacturer1 Part Number: 232270672209L; PressFit: No; Part Number: R0402_22R_1%_0.0625W_100PPM; Component Kind: Standard; Component Type: Standard; Pin Count: 2; Value: 22; Status: Not Recommended; Power: 0.0625W; Tolerance: ±1%; Manufacturer Part Number: R0402_22R_1%_0.0625W_100PPM; Case: 0402; Mounted: Yes; Socket: No; SMD: Yes; Manufacturer1 Example: YAGEO PHYCOMP; Manufacturer1 ComponentHeight: 0.4mm; HelpURL: \\cern.ch\dfs\Applications\Altium\Datasheets\R0402_Phycomp_RC0402.pdf; Author: CERN DEM JLC; CreateDate: 03.12.2007; LatestRevisionDate: 17.10.2012; Sense: No
T_R19 = R0402_200R_1%_0.0625W_100PPM: Resistor - 1%; Part Description: General Purpose Thick Film Chip Resistor; Manufacturer: GENERIC; Manufacturer1 Part Number: 232270672001L; TC: ±100ppm/°C; PressFit: No; Part Number: R0402_200R_1%_0.0625W_100PPM; Component Kind: Standard; Component Type: Standard; Pin Count: 2; Value: 200; Status: Not Recommended; Power: 0.0625W; Tolerance: ±1%; Manufacturer Part Number: R0402_200R_1%_0.0625W_100PPM; Case: 0402; Mounted: Yes; Sense: No; Socket: No; SMD: Yes; Manufacturer1 Example: YAGEO PHYCOMP; Manufacturer1 ComponentHeight: 0.4mm; HelpURL: \\cern.ch\dfs\Applications\Altium\Datasheets\R0402_Phycomp_RC0402.pdf; Author: CERN DEM JLC; CreateDate: 2007-12-03; LatestRevisionDate: 2012-10-17

## Sheet DIOT_signal_routing.SchDoc: =DocumentName
size A4; DocumentNumber: 1; Revision: 0; SheetNumber: 9; SheetTotal: 20; Version: 1.6; Author 1: Grzegorz Kasprowicz; Author 2: Filip Światkowski, Paweł Kulik, Maciej Przybysz; Author 3: Krzysztof Belewicz; Github: https://github.com/sinara-hw/Urukul; Last modified by: Krzysztof Belewicz
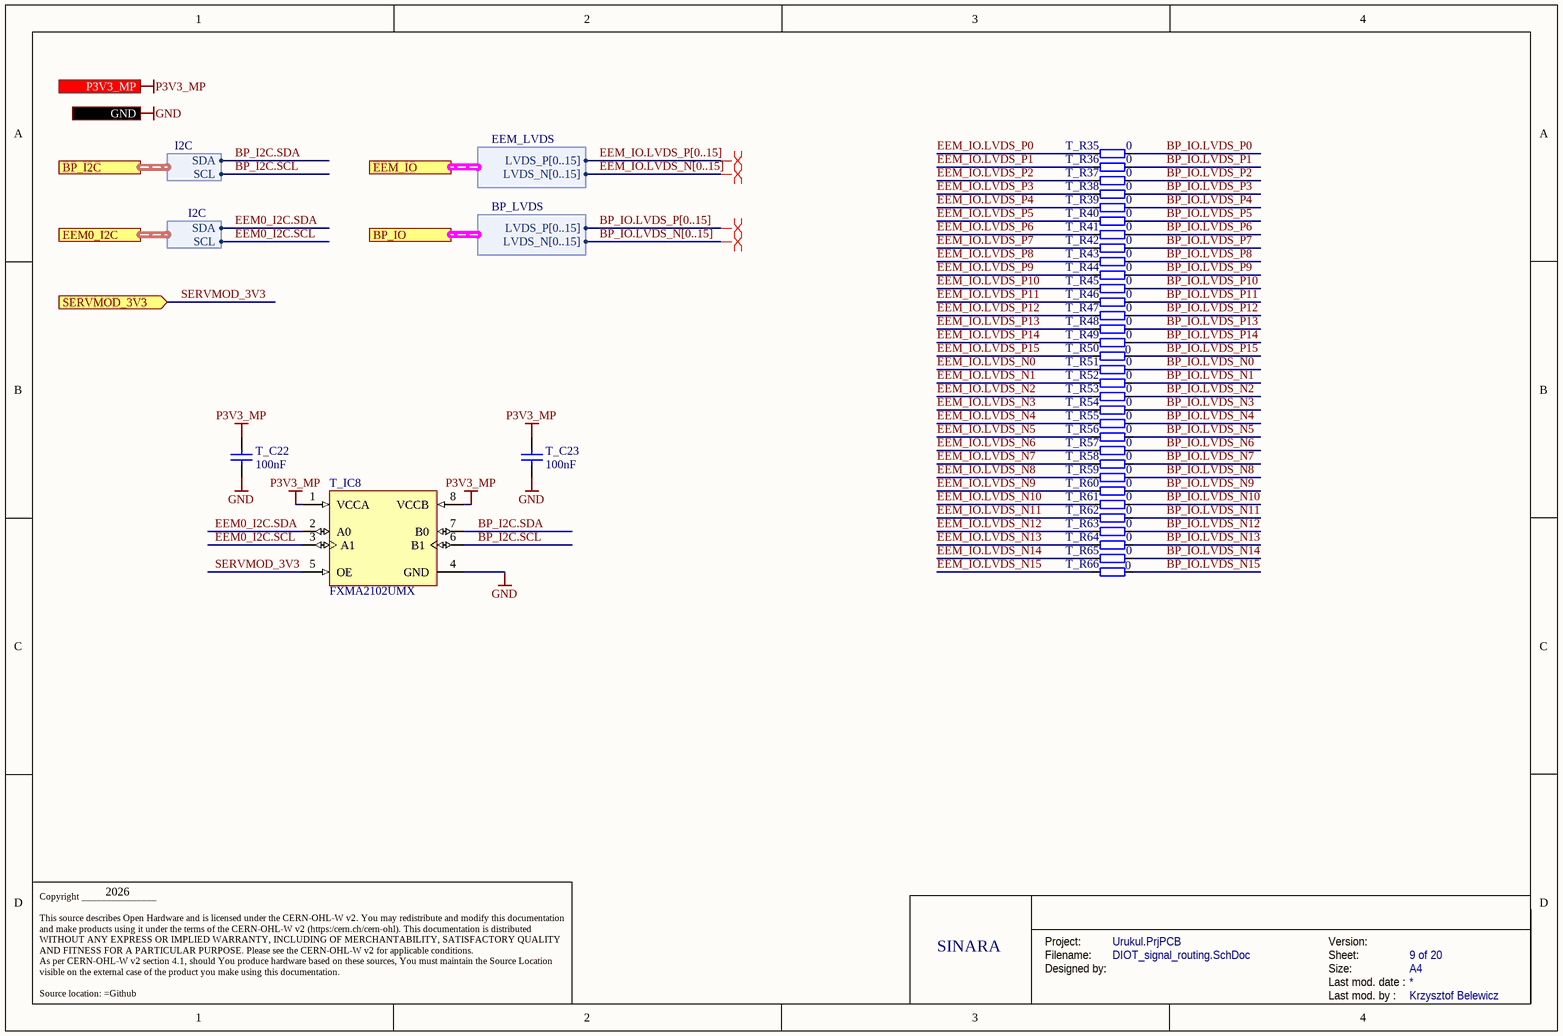
[diagram p2: DIOT_signal_routing.SchDoc]

### Parts
T_C22  100nF  [CAPC1005X55N]
T_C23  100nF  [CAPC1005X55N]
T_IC8  FXMA2102UMX  [FXMA2102UMX]
T_R35  0  [RESC1005X40N]
T_R36  0  [RESC1005X40N]
T_R37  0  [RESC1005X40N]
T_R38  0  [RESC1005X40N]
T_R39  0  [RESC1005X40N]
T_R40  0  [RESC1005X40N]
T_R41  0  [RESC1005X40N]
T_R42  0  [RESC1005X40N]
T_R43  0  [RESC1005X40N]
T_R44  0  [RESC1005X40N]
T_R45  0  [RESC1005X40N]
T_R46  0  [RESC1005X40N]
T_R47  0  [RESC1005X40N]
T_R48  0  [RESC1005X40N]
T_R49  0  [RESC1005X40N]
T_R50  0  [RESC1005X40N]
T_R51  0  [RESC1005X40N]
T_R52  0  [RESC1005X40N]
T_R53  0  [RESC1005X40N]
T_R54  0  [RESC1005X40N]
T_R55  0  [RESC1005X40N]
T_R56  0  [RESC1005X40N]
T_R57  0  [RESC1005X40N]
T_R58  0  [RESC1005X40N]
T_R59  0  [RESC1005X40N]
T_R60  0  [RESC1005X40N]
T_R61  0  [RESC1005X40N]
T_R62  0  [RESC1005X40N]
T_R63  0  [RESC1005X40N]
T_R64  0  [RESC1005X40N]
T_R65  0  [RESC1005X40N]
T_R66  0  [RESC1005X40N]

### Ports
BP_I2C (harness I2C), BP_IO (harness BP_LVDS), EEM0_I2C (harness I2C), EEM_IO (harness EEM_LVDS), GND, P3V3_MP (in), SERVMOD_3V3 (in)

### Harnesses
I2C: SDA, SCL
EEM_LVDS: LVDS_P[0..15], LVDS_N[0..15]
BP_LVDS: LVDS_P[0..15], LVDS_N[0..15]

### Nets
GND: T_C22.1 T_C23.1 T_IC8.4(GND) ; port GND
P3V3_MP: T_C22.2 T_C23.2 T_IC8.1(VCCA) T_IC8.8(VCCB) ; port P3V3_MP
BP_I2C.SCL: T_IC8.6(B1) ; port BP_I2C.SCL
BP_I2C.SDA: T_IC8.7(B0) ; port BP_I2C.SDA
BP_IO.LVDS_N0: T_R51.1
BP_IO.LVDS_N1: T_R52.1
BP_IO.LVDS_N2: T_R53.1
BP_IO.LVDS_N3: T_R54.1
BP_IO.LVDS_N4: T_R55.1
BP_IO.LVDS_N5: T_R56.1
BP_IO.LVDS_N6: T_R57.1
BP_IO.LVDS_N7: T_R58.1
BP_IO.LVDS_N8: T_R59.1
BP_IO.LVDS_N9: T_R60.1
BP_IO.LVDS_N10: T_R61.1
BP_IO.LVDS_N11: T_R62.1
BP_IO.LVDS_N12: T_R63.1
BP_IO.LVDS_N13: T_R64.1
BP_IO.LVDS_N14: T_R65.1
BP_IO.LVDS_N15: T_R66.2
BP_IO.LVDS_P0: T_R35.1
BP_IO.LVDS_P1: T_R36.1
BP_IO.LVDS_P2: T_R37.1
BP_IO.LVDS_P3: T_R38.1
BP_IO.LVDS_P4: T_R39.1
BP_IO.LVDS_P5: T_R40.1
BP_IO.LVDS_P6: T_R41.1
BP_IO.LVDS_P7: T_R42.1
BP_IO.LVDS_P8: T_R43.1
BP_IO.LVDS_P9: T_R44.1
BP_IO.LVDS_P10: T_R45.1
BP_IO.LVDS_P11: T_R46.1
BP_IO.LVDS_P12: T_R47.1
BP_IO.LVDS_P13: T_R48.1
BP_IO.LVDS_P14: T_R49.1
BP_IO.LVDS_P15: T_R50.2
EEM0_I2C.SCL: T_IC8.3(A1) ; port EEM0_I2C.SCL
EEM0_I2C.SDA: T_IC8.2(A0) ; port EEM0_I2C.SDA
EEM_IO.LVDS_N0: T_R51.2
EEM_IO.LVDS_N1: T_R52.2
EEM_IO.LVDS_N2: T_R53.2
EEM_IO.LVDS_N3: T_R54.2
EEM_IO.LVDS_N4: T_R55.2
EEM_IO.LVDS_N5: T_R56.2
EEM_IO.LVDS_N6: T_R57.2
EEM_IO.LVDS_N7: T_R58.2
EEM_IO.LVDS_N8: T_R59.2
EEM_IO.LVDS_N9: T_R60.2
EEM_IO.LVDS_N10: T_R61.2
EEM_IO.LVDS_N11: T_R62.2
EEM_IO.LVDS_N12: T_R63.2
EEM_IO.LVDS_N13: T_R64.2
EEM_IO.LVDS_N14: T_R65.2
EEM_IO.LVDS_N15: T_R66.1
EEM_IO.LVDS_P0: T_R35.2
EEM_IO.LVDS_P1: T_R36.2
EEM_IO.LVDS_P2: T_R37.2
EEM_IO.LVDS_P3: T_R38.2
EEM_IO.LVDS_P4: T_R39.2
EEM_IO.LVDS_P5: T_R40.2
EEM_IO.LVDS_P6: T_R41.2
EEM_IO.LVDS_P7: T_R42.2
EEM_IO.LVDS_P8: T_R43.2
EEM_IO.LVDS_P9: T_R44.2
EEM_IO.LVDS_P10: T_R45.2
EEM_IO.LVDS_P11: T_R46.2
EEM_IO.LVDS_P12: T_R47.2
EEM_IO.LVDS_P13: T_R48.2
EEM_IO.LVDS_P14: T_R49.2
EEM_IO.LVDS_P15: T_R50.1
SERVMOD_3V3: T_IC8.5(OE) ; port SERVMOD_3V3

### Buses and harness runs
bus BP_IO.LVDS_N[0..15]
bus BP_IO.LVDS_P[0..15]
bus EEM_IO.LVDS_N[0..15]
bus EEM_IO.LVDS_P[0..15]

### Layout directives
differential pair; differential pair class Diff_100Ohm: (no net found under the mark)
differential pair: (no net found under the mark)

### Notes on the sheet
- 2026
- SINARA
- Project:
- Designed by:
- Filename:
- Size:
- Version:
- Last mod. date :
- Sheet:
- A4
- Copyright _______________
  This source describes Open Hardware and is licensed under the CERN-OHL-W v2. You may redistribute and modify this documentation and make products using it under the terms of the CERN-OHL-W v2 (https:/cern.ch/cern-ohl). This documentation is distributed WITHOUT ANY EXPRESS OR IMPLIED WARRANTY, INCLUDING OF MERCHANTABILITY, SATISFACTORY QUALITY AND FITNESS FOR A PARTICULAR PURPOSE. Please see the CERN-OHL-W v2 for applicable conditions.
  As per CERN-OHL-W v2 section 4.1, should You produce hardware based on these sources, You must maintain the Source Location visible on the external case of the product you make using this documentation.
  Source location: =Github
- Last mod. by :

### Library data of the parts
T_C22 T_C23 = CC0402_100NF_16V_10%_X5R: Non-polarised capacitor; Part Description: SMD Multilayer Chip Ceramic Capacitor; Manufacturer: GENERIC; Manufacturer1 Part Number: GRM155R61C104KA88D; Voltage: 16V; TC: X5R; Tolerance: ±10%; Part Number: CC0402_100NF_16V_10%_X5R; Component Kind: Standard; Component Type: Standard; Pin Count: 2; Value: 100nF; Status: None; Manufacturer Part Number: CC0402_100NF_16V_10%_X5R; Case: 0402; Mounted: Yes; Socket: No; SMD: Yes; Sense: No; Manufacturer1 Example: MURATA; Manufacturer1 ComponentHeight: 0.55mm; HelpURL: \\cern.ch\dfs\Applications\Altium\Datasheets\CC0402_X5R_MURATA_GRM.pdf; Author: CERN DEM JLC; CreateDate: 10.12.2013; LatestRevisionDate: 10.12.2013
T_IC8 = CMP-015-00014-1: Dual Supply 2-Bit Voltage Translator/Buffer/Repeater Isolator for I2C Applications; Manufacturer: Onsemi; Max Supply Voltage: 5.5V; Min Supply Voltage: 1.65V; Min Operating Temperature: -40°C; Pins: 8; Max Operating Temperature: 85°C; Manufacaturer Part Number: FXMA2102UMX; Mounting Technology: Surface Mount
T_R35-T_R66 = R0402_0R_JUMPER: Resistor; Part Description: 1A (0.05R Max DC Resistance) Zero Ohm Jumper; Manufacturer: GENERIC; Manufacturer1 Part Number: 232270591001L; PressFit: No; Part Number: R0402_0R_JUMPER; Component Kind: Standard; Component Type: Standard; Pin Count: 2; Value: 0; Status: Not Recommended; Manufacturer Part Number: R0402_0R_JUMPER; Case: 0402; Mounted: Yes; Sense: No; Socket: No; SMD: Yes; Manufacturer1 Example: YAGEO PHYCOMP; Manufacturer1 ComponentHeight: 0.4mm; HelpURL: \\cern.ch\dfs\Applications\Altium\Datasheets\R0402_Phycomp_RC0402.pdf; Author: CERN DEM JLC; CreateDate: 03.12.2007; LatestRevisionDate: 17.10.2012

## Sheet EEM_Connectors.SchDoc: =DocumentName
size A4; SPICEModelCacheVGBTAUBO: <root> / <DocumentId>VGBTAUBO</DocumentId> / </root>; DocumentNumber: 1; Revision: 0; SheetNumber: 7; SheetTotal: 20; Version: 1.6; Author 1: Grzegorz Kasprowicz; Author 2: Filip Światkowski, Paweł Kulik, Maciej Przybysz; Author 3: Krzysztof Belewicz; Github: https://github.com/sinara-hw/Urukul; Last modified by: Krzysztof Belewicz
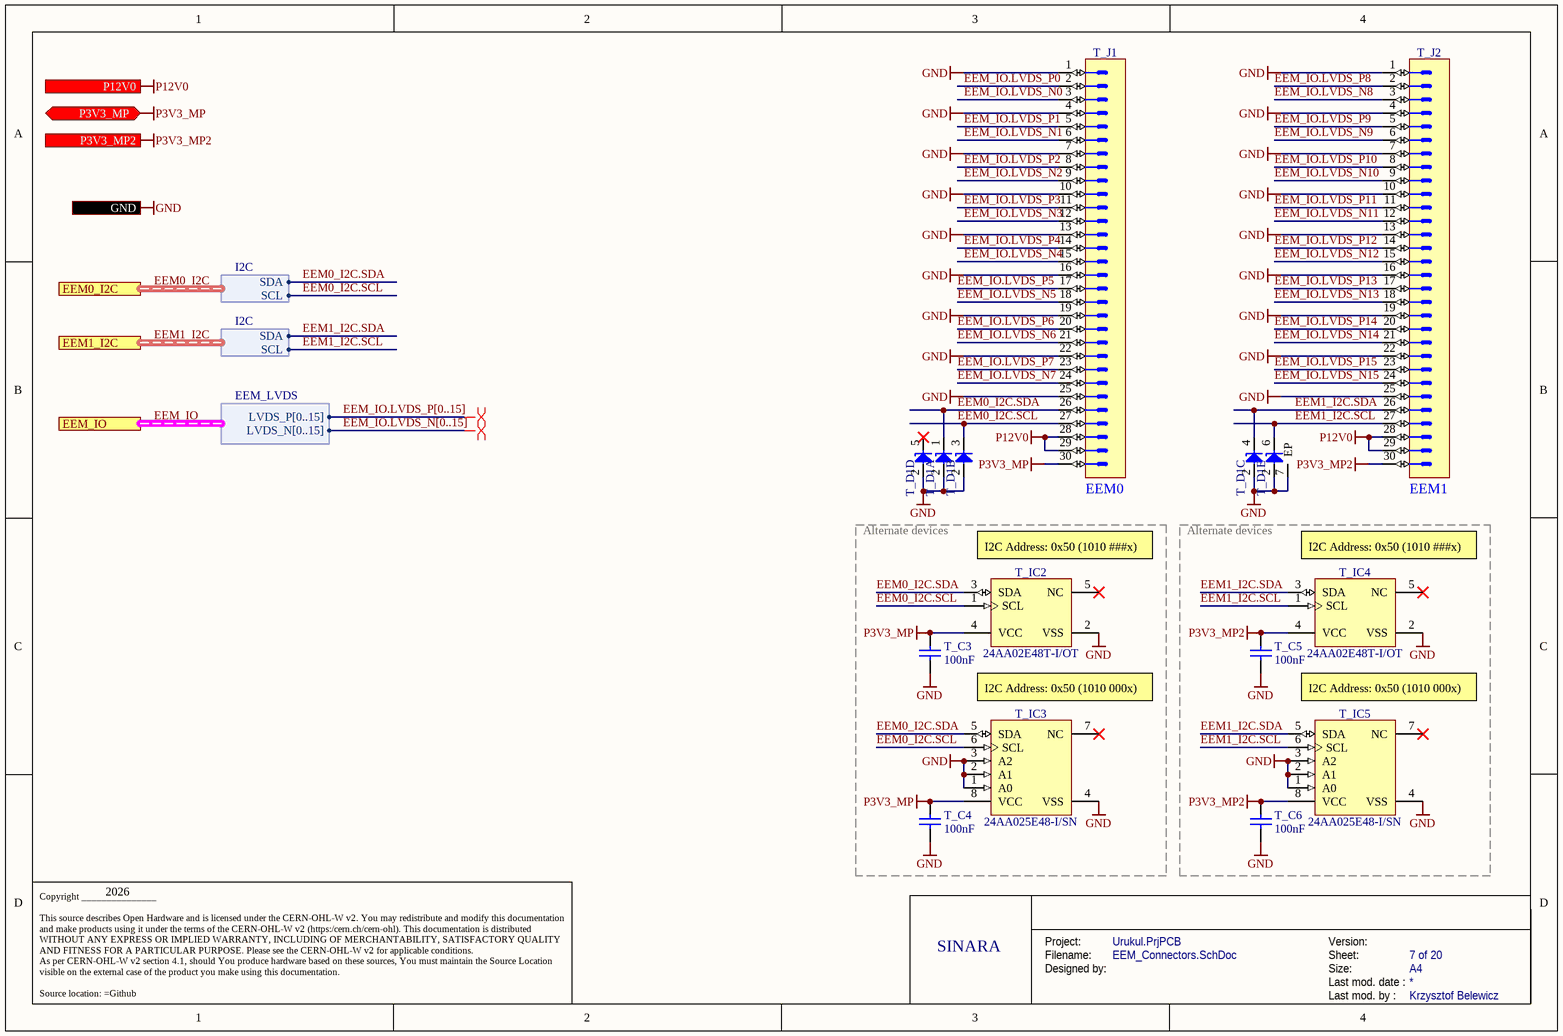
[diagram p3: EEM_Connectors.SchDoc]

### Parts
T_C3  100nF  [CAPC1005X55N]
T_C4  100nF  [CAPC1005X55N]
T_C5  100nF  [CAPC1005X55N]
T_C6  100nF  [CAPC1005X55N]
T_D1  UCLAMP3305P.TCT  [SON50P160X65_HS-7N]  (value not drawn)  (parts A,B,C,D,E of 5)
T_IC2  24AA02E48T-I/OT  [SOT95P280X145-5N]
T_IC3  24AA025E48-I/SN  [SOIC127P600X175-8N]
T_IC4  24AA02E48T-I/OT  [SOT95P280X145-5N]
T_IC5  24AA025E48-I/SN  [SOIC127P600X175-8N]
T_J1  (no value)  [3M_N2530-6002RB]
T_J2  (no value)  [3M_N2530-6002RB]

### Blocks framed on the sheet
Alternate devices: T_C3 T_C4 T_IC2 T_IC3
Alternate devices: T_C5 T_C6 T_IC4 T_IC5

### Ports
EEM0_I2C (harness I2C), EEM1_I2C (harness I2C), EEM_IO (harness EEM_LVDS), GND, P3V3_MP2 (out), P3V3_MP (bidir), P12V0 (out)

### Harnesses
EEM_LVDS: LVDS_P[0..15], LVDS_N[0..15]
I2C: SDA, SCL

### Nets
GND: T_C3.1 T_C4.1 T_C5.1 T_C6.1 T_D1.2(A) T_D1.7(EP) T_IC2.2(VSS) T_IC3.1(A0) T_IC3.2(A1) T_IC3.3(A2) T_IC3.4(VSS) T_IC4.2(VSS) T_IC5.1(A0) T_IC5.2(A1) T_IC5.3(A2) T_IC5.4(VSS) T_J1.1 T_J1.4 T_J1.7 T_J1.10 T_J1.13 T_J1.16 T_J1.19 T_J1.22 T_J1.25 T_J2.1 T_J2.4 T_J2.7 T_J2.10 T_J2.13 T_J2.16 T_J2.19 T_J2.22 T_J2.25 ; port GND
P3V3_MP: T_C3.2 T_C4.2 T_IC2.4(VCC) T_IC3.8(VCC) T_J1.30 ; port P3V3_MP
P3V3_MP2: T_C5.2 T_C6.2 T_IC4.4(VCC) T_IC5.8(VCC) T_J2.30 ; port P3V3_MP2
P12V0: T_J1.28 T_J1.29 T_J2.28 T_J2.29 ; port P12V0
EEM0_I2C.SCL: T_D1.3(C) T_IC2.1(SCL) T_IC3.6(SCL) T_J1.27 ; port EEM0_I2C.SCL
EEM0_I2C.SDA: T_D1.1(C) T_IC2.3(SDA) T_IC3.5(SDA) T_J1.26 ; port EEM0_I2C.SDA
EEM1_I2C.SCL: T_D1.6(C) T_IC4.1(SCL) T_IC5.6(SCL) T_J2.27 ; port EEM1_I2C.SCL
EEM1_I2C.SDA: T_D1.4(C) T_IC4.3(SDA) T_IC5.5(SDA) T_J2.26 ; port EEM1_I2C.SDA
EEM_IO.LVDS_N0: T_J1.3
EEM_IO.LVDS_N1: T_J1.6
EEM_IO.LVDS_N2: T_J1.9
EEM_IO.LVDS_N3: T_J1.12
EEM_IO.LVDS_N4: T_J1.15
EEM_IO.LVDS_N5: T_J1.18
EEM_IO.LVDS_N6: T_J1.21
EEM_IO.LVDS_N7: T_J1.24
EEM_IO.LVDS_N8: T_J2.3
EEM_IO.LVDS_N9: T_J2.6
EEM_IO.LVDS_N10: T_J2.9
EEM_IO.LVDS_N11: T_J2.12
EEM_IO.LVDS_N12: T_J2.15
EEM_IO.LVDS_N13: T_J2.18
EEM_IO.LVDS_N14: T_J2.21
EEM_IO.LVDS_N15: T_J2.24
EEM_IO.LVDS_P0: T_J1.2
EEM_IO.LVDS_P1: T_J1.5
EEM_IO.LVDS_P2: T_J1.8
EEM_IO.LVDS_P3: T_J1.11
EEM_IO.LVDS_P4: T_J1.14
EEM_IO.LVDS_P5: T_J1.17
EEM_IO.LVDS_P6: T_J1.20
EEM_IO.LVDS_P7: T_J1.23
EEM_IO.LVDS_P8: T_J2.2
EEM_IO.LVDS_P9: T_J2.5
EEM_IO.LVDS_P10: T_J2.8
EEM_IO.LVDS_P11: T_J2.11
EEM_IO.LVDS_P12: T_J2.14
EEM_IO.LVDS_P13: T_J2.17
EEM_IO.LVDS_P14: T_J2.20
EEM_IO.LVDS_P15: T_J2.23

Not connected (* = marked no-connect by the designer): T_D1 5(C)*; T_IC2 5(NC)*; T_IC3 7(NC)*; T_IC4 5(NC)*; T_IC5 7(NC)*

### Buses and harness runs
bus EEM_IO.LVDS_N[0..15]
bus EEM_IO.LVDS_P[0..15]
harness EEM0_I2C = port EEM0_I2C
harness EEM1_I2C = port EEM1_I2C
harness EEM_IO = port EEM_IO

### Layout directives
differential pair; differential pair class Diff_100Ohm: (no net found under the mark)

### Notes on the sheet
- (near T_J1) EEM0
- (near T_J2) EEM1
- (near T_IC2) I2C Address: 0x50 (1010 ###x)
- (near T_IC4) I2C Address: 0x50 (1010 ###x)
- I2C Address: 0x50 (1010 000x)
- 2026
- SINARA
- Project:
- Designed by:
- Filename:
- Size:
- Version:
- Last mod. date :
- Sheet:
- A4
- Copyright _______________
  This source describes Open Hardware and is licensed under the CERN-OHL-W v2. You may redistribute and modify this documentation and make products using it under the terms of the CERN-OHL-W v2 (https:/cern.ch/cern-ohl). This documentation is distributed WITHOUT ANY EXPRESS OR IMPLIED WARRANTY, INCLUDING OF MERCHANTABILITY, SATISFACTORY QUALITY AND FITNESS FOR A PARTICULAR PURPOSE. Please see the CERN-OHL-W v2 for applicable conditions.
  As per CERN-OHL-W v2 section 4.1, should You produce hardware based on these sources, You must maintain the Source Location visible on the external case of the product you make using this documentation.
  Source location: =Github
- Last mod. by :

### Library data of the parts
T_C3-T_C6 = CC0402_100NF_16V_10%_X5R: as T_C22 on sheet DIOT_signal_routing; Part Number: CC0402_100NF_16V_10%_X5R; Component Kind: Standard; Component Type: Standard; Pin Count: 2; Value: 100nF; Status: None; Manufacturer Part Number: CC0402_100NF_16V_10%_X5R; Case: 0402; Mounted: Yes; Socket: No; SMD: Yes; Sense: No; Manufacturer1 Example: MURATA; Manufacturer1 ComponentHeight: 0.55mm; HelpURL: \\cern.ch\dfs\Applications\Altium\Datasheets\CC0402_X5R_MURATA_GRM.pdf; Author: CERN DEM JLC; CreateDate: 10.12.2013; LatestRevisionDate: 10.12.2013
T_D1 = CMP-004-00037-2: as T_D2 on sheet CPCIS_Connectors_P1_P6; Max Operating Temperature: 125°C; Min Operating Temperature: -55°C; Pins: 6; Mounting Technology: Surface Mount
T_IC2 T_IC4 = 24AA02E48T-I/OT: 1.7V-5.5V, 2K I2C Serial EEPROM With EUI-48 Node Identity; Manufacturer: MICROCHIP TECHNOLOGY; PressFit: No; Bonding: No; Part Number: 24AA02E48T-I/OT; Component Kind: Standard; Component Type: Standard; Device: 24AA02E48T-I/OT; PackageDescription: SOT, 0.95mm pitch; 5 pin, 1.60mm W X 2.90mm L X 1.45mm H body, IPC Medium Density; Part Description: 1.7V-5.5V, 2K I2C Serial EEPROM with EUI-48 Node Identity; Manufacturer Part Number: 24AA02E48T-I/OT; Pin Count: 5; Case: SOT23-5; Mounted: Yes; Socket: No; SMD: Yes; Sense: No; ComponentHeight: 1.45mm; HelpURL: \\cern.ch\dfs\Applications\Altium\Datasheets\24AA02E48T-I-OT.pdf; Author: CERN DEM MR; CreateDate: 31.03.2016; LatestRevisionDate: 31.03.2016
T_IC3 T_IC5 = 24AA025E48-I/SN: 1.7V-5.5V, 2K I2C™ Serial EEPROMs with EUI-48™ Node Identity; Manufacturer: MICROCHIP TECHNOLOGY; PressFit: No; Bonding: No; Part Number: 24AA025E48-I/SN; Component Kind: Standard; Component Type: Standard; Device: 24AA025E48-I/SN; PackageDescription: SOIC 8, Pitch 1.27mm - Body 4x5mm, IPC Medium Density; Part Description: 1.7V-5.5V, 2K I2C™ Serial EEPROMs with EUI-48™ Node Identity; Manufacturer Part Number: 24AA025E48-I/SN; Pin Count: 8; Case: SOIC8; Mounted: Yes; Socket: No; SMD: Yes; Sense: No; ComponentHeight: 1.75mm; HelpURL: \\cern.ch\dfs\Applications\Altium\Datasheets\24AA025E48-I-SN.pdf; Author: CERN DEM MR; CreateDate: 19.07.2016; LatestRevisionDate: 19.07.2016
T_J1 T_J2 = 3M_N2530-6002RB: Connector 30 Male; Part Description: 30 Contacts - Straight .100'' x .100'' Low Profile Four-Wall Header, 2500 Series; Manufacturer: 3M; PressFit: No; Part Number: 3M_N2530-6002RB; Component Kind: Standard; Component Type: Standard; Pin Count: 30; Family: Header 30; Mounted: Yes; Socket: No; SMD: No; Sense: No; Status: None; Manufacturer Part Number: N2530-6002RB; ComponentHeight: 10.03mm; HelpURL: \\cern.ch\dfs\Applications\Altium\Datasheets\3M_N2530-6002RB.pdf; Author: CERN DEM JLC; CreateDate: 11.02.2009; LatestRevisionDate: 11.08.2009

## Sheet Temperature_monitoring.SchDoc: =DocumentName
size A4; DocumentNumber: 1; Revision: 0; SheetNumber: 12; SheetTotal: 20; Version: 1.6; Author 1: Grzegorz Kasprowicz; Author 2: Filip Światkowski, Paweł Kulik, Maciej Przybysz; Author 3: Krzysztof Belewicz; Github: https://github.com/sinara-hw/Urukul; Last modified by: Krzysztof Belewicz
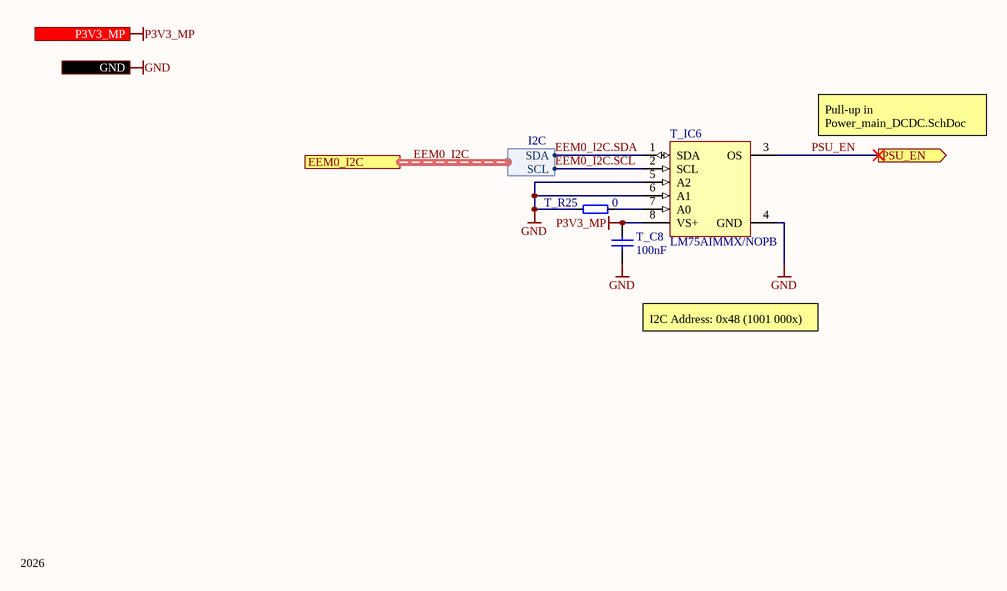
[diagram p4: Temperature_monitoring.SchDoc]

### Parts
T_C8  100nF  [CAPC1005X55N]
T_IC6  LM75AIMMX/NOPB  [DGK0008A_M]
T_R25  0  [RESC1005X40N]

### Ports
EEM0_I2C (harness I2C), GND, P3V3_MP (in), PSU_EN (out)

### Harnesses
I2C: SDA, SCL

### Nets
GND: T_C8.1 T_IC6.4(GND) T_IC6.5(A2) T_IC6.6(A1) T_R25.1 ; port GND
P3V3_MP: T_C8.2 T_IC6.8(VS+) ; port P3V3_MP
EEM0_I2C.SCL: T_IC6.2(SCL) ; port EEM0_I2C.SCL
EEM0_I2C.SDA: T_IC6.1(SDA) ; port EEM0_I2C.SDA
PSU_EN: T_IC6.3(OS) ; port PSU_EN
NetT_IC6_7: T_IC6.7(A0) T_R25.2

### Buses and harness runs
harness EEM0_I2C = port EEM0_I2C

### Notes on the sheet
- Pull-up in Power_main_DCDC.SchDoc
- I2C Address: 0x48 (1001 000x)
- 2026
- SINARA
- Project:
- Designed by:
- Filename:
- Size:
- Version:
- Last mod. date :
- Sheet:
- A4
- Copyright _______________
  This source describes Open Hardware and is licensed under the CERN-OHL-W v2. You may redistribute and modify this documentation and make products using it under the terms of the CERN-OHL-W v2 (https:/cern.ch/cern-ohl). This documentation is distributed WITHOUT ANY EXPRESS OR IMPLIED WARRANTY, INCLUDING OF MERCHANTABILITY, SATISFACTORY QUALITY AND FITNESS FOR A PARTICULAR PURPOSE. Please see the CERN-OHL-W v2 for applicable conditions.
  As per CERN-OHL-W v2 section 4.1, should You produce hardware based on these sources, You must maintain the Source Location visible on the external case of the product you make using this documentation.
  Source location: =Github
- Last mod. by :

### Library data of the parts
T_C8 = CC0402_100NF_16V_10%_X5R: as T_C22 on sheet DIOT_signal_routing; Part Number: CC0402_100NF_16V_10%_X5R; Component Kind: Standard; Component Type: Standard; Pin Count: 2; Value: 100nF; Status: None; Manufacturer Part Number: CC0402_100NF_16V_10%_X5R; Case: 0402; Mounted: Yes; Socket: No; SMD: Yes; Sense: No; Manufacturer1 Example: MURATA; Manufacturer1 ComponentHeight: 0.55mm; HelpURL: \\cern.ch\dfs\Applications\Altium\Datasheets\CC0402_X5R_MURATA_GRM.pdf; Author: CERN DEM JLC; CreateDate: 10.12.2013; LatestRevisionDate: 10.12.2013
T_IC6 = CMP-010-00652-2: Serial Switch/Digital Sensor, 9 Bit(s), 3Cel, Square, 8 Pin, Surface Mount; Min Supply Voltage: 2.7V; Max Supply Voltage: 5.5V; Sensor Type: TEMPERATURE SENSOR,SWITCH/DIGITAL OUTPUT,SERIAL; Max Operating Temperature: 125°C; Min Operating Temperature: -55°C; Pins: 8; RoHS Compliant: Yes; Mounting Technology: Surface Mount
T_R25 = R0402_0R_JUMPER: Resistor; Part Description: 1A (0.05R Max DC Resistance) Zero Ohm Jumper; Manufacturer: GENERIC; Manufacturer1 Part Number: 232270591001L; Part Number: R0402_0R_JUMPER; Component Kind: Standard; Component Type: Standard; Pin Count: 2; Value: 0; Status: Not recommended; Manufacturer Part Number: R0402_0R_JUMPER; Case: 0402; Mounted: Yes; Sense: No; Socket: No; SMD: Yes; Manufacturer1 Example: YAGEO PHYCOMP; Manufacturer1 ComponentHeight: 0.4mm; HelpURL: \\cern.ch\dfs\Applications\Altium\Datasheets\R0402_Phycomp_RC0402.pdf; Author: CERN DEM JLC; CreateDate: 03.12.2007; LatestRevisionDate: 17.10.2012